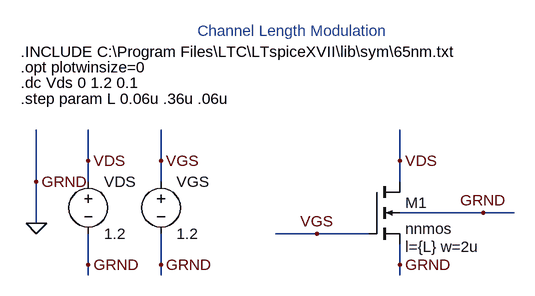
[diagram p0: schematic 3Channel Length Modulation.asc]
3Channel Length Modulation.asc, the LTspice schematic file:
Version 4
SHEET 1 880 680
WIRE -192 160 -192 112
WIRE -80 160 -80 112
WIRE 288 160 288 112
WIRE -272 192 -272 112
WIRE -192 192 -192 160
WIRE -80 192 -80 160
WIRE 288 192 288 160
WIRE 416 240 288 240
WIRE 464 240 416 240
WIRE -272 256 -272 192
WIRE 160 272 96 272
WIRE 240 272 160 272
WIRE -192 320 -192 272
WIRE -80 320 -80 272
WIRE 288 320 288 288
WIRE -192 336 -192 320
WIRE -80 336 -80 320
WIRE 288 336 288 320
FLAG -272 256 0
FLAG 160 272 VGS
FLAG -80 160 VGS
FLAG 288 160 VDS
FLAG -192 160 VDS
FLAG -272 192 GRND
FLAG 288 320 GRND
FLAG 416 240 GRND
FLAG -80 320 GRND
FLAG -192 320 GRND
SYMBOL nmos4 240 192 R0
WINDOW 123 56 100 Left 2
SYMATTR Value2 l={L} w=2u
SYMATTR InstName M1
SYMATTR Value nnmos
SYMBOL voltage -192 176 R0
SYMATTR InstName VDS
SYMATTR Value 1.2
SYMBOL voltage -80 176 R0
SYMATTR InstName VGS
SYMATTR Value 1.2
TEXT -296 -8 Left 2 !.INCLUDE C:\\Program Files\\LTC\\LTspiceXVII\\lib\\sym\\65nm.txt
TEXT -296 16 Left 2 !.opt plotwinsize=0
TEXT -296 40 Left 2 !.dc Vds 0 1.2 0.1
TEXT -296 64 Left 2 !.step param L 0.06u .36u .06u
TEXT -24 -40 Left 2 ;Channel Length Modulation

The netlist it stands for:
* 3Channel Length Modulation.asc
M1 VDS VGS 0 0 nnmos l={L} w=2u
VDS VDS 0 1.2
VGS VGS 0 1.2
.model NMOS NMOS
.model PMOS PMOS
.lib standard.mos
.INCLUDE C:\Program Files\LTC\LTspiceXVII\lib\sym\65nm.txt
.opt plotwinsize=0
.dc Vds 0 1.2 0.1
.step param L 0.06u .36u .06u
* Channel Length Modulation
.backanno
.end